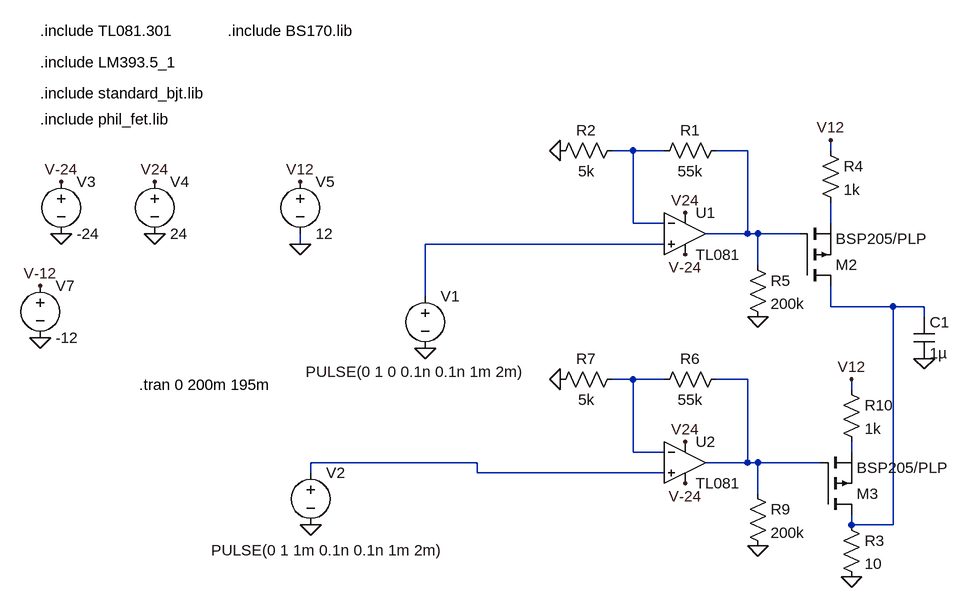
[diagram p0: schematic Prueba_FCorr_MOSfet.asc]
Prueba_FCorr_MOSfet.asc, the LTspice schematic file:
Version 4
SHEET 1 1780 1156
WIRE 752 240 720 240
WIRE 800 240 752 240
WIRE 928 240 880 240
WIRE 1056 240 1056 224
WIRE 752 352 752 240
WIRE 800 352 752 352
WIRE 1056 352 1056 320
WIRE 928 368 928 240
WIRE 928 368 864 368
WIRE 944 368 928 368
WIRE 1008 368 944 368
WIRE 240 384 240 368
WIRE 800 384 432 384
WIRE 944 416 944 368
WIRE 432 464 432 384
WIRE 1056 480 1056 448
WIRE 1152 480 1056 480
WIRE 1200 480 1152 480
WIRE 1200 496 1200 480
WIRE 752 592 720 592
WIRE 800 592 752 592
WIRE 928 592 880 592
WIRE 1088 608 1088 592
WIRE 752 704 752 592
WIRE 800 704 752 704
WIRE 1088 704 1088 688
WIRE 512 720 256 720
WIRE 928 720 928 592
WIRE 928 720 864 720
WIRE 944 720 928 720
WIRE 1040 720 944 720
WIRE 256 736 256 720
WIRE 512 736 512 720
WIRE 800 736 512 736
WIRE 944 768 944 720
WIRE 1088 816 1088 800
WIRE 1152 816 1152 480
WIRE 1152 816 1088 816
FLAG 256 816 0
FLAG 432 544 0
FLAG -128 368 0
FLAG 16 368 0
FLAG -128 288 V-24
FLAG 16 288 V24
FLAG 240 384 0
FLAG 240 288 V12
FLAG 640 240 0
FLAG 832 336 V24
FLAG 1056 224 V12
FLAG 944 496 0
FLAG 832 400 V-24
FLAG -160 528 0
FLAG -160 448 V-12
FLAG 1200 560 0
FLAG 640 592 0
FLAG 832 688 V24
FLAG 1088 592 V12
FLAG 944 848 0
FLAG 832 752 V-24
FLAG 1088 896 0
SYMBOL voltage 432 448 R0
WINDOW 123 0 0 Left 0
WINDOW 39 0 0 Left 0
WINDOW 3 -184 132 Left 2
SYMATTR Value PULSE(0 1 0 0.1n 0.1n 1m 2m)
SYMATTR InstName V1
SYMBOL voltage 256 720 R0
WINDOW 123 0 0 Left 0
WINDOW 39 0 0 Left 0
WINDOW 3 -153 135 Left 2
SYMATTR Value PULSE(0 1 1m 0.1n 0.1n 1m 2m)
SYMATTR InstName V2
SYMBOL voltage -128 272 R0
WINDOW 123 0 0 Left 0
WINDOW 39 0 0 Left 0
SYMATTR InstName V3
SYMATTR Value -24
SYMBOL voltage 16 272 R0
WINDOW 123 0 0 Left 0
WINDOW 39 0 0 Left 0
SYMATTR InstName V4
SYMATTR Value 24
SYMBOL voltage 240 272 R0
WINDOW 123 0 0 Left 0
WINDOW 39 0 0 Left 0
SYMATTR InstName V5
SYMATTR Value 12
SYMBOL Opamps\\opamp2 832 304 R0
SYMATTR InstName U1
SYMATTR Value TL081
SYMBOL res 896 224 R90
WINDOW 0 0 56 VBottom 2
WINDOW 3 32 56 VTop 2
SYMATTR InstName R1
SYMATTR Value 55k
SYMBOL res 736 224 R90
WINDOW 0 0 56 VBottom 2
WINDOW 3 32 56 VTop 2
SYMATTR InstName R2
SYMATTR Value 5k
SYMBOL pmos 1008 448 M180
SYMATTR InstName M2
SYMATTR Value BSP205/PLP
SYMATTR Prefix X
SYMBOL res 928 400 R0
SYMATTR InstName R5
SYMATTR Value 200k
SYMBOL voltage -160 432 R0
WINDOW 123 0 0 Left 0
WINDOW 39 0 0 Left 0
SYMATTR InstName V7
SYMATTR Value -12
SYMBOL res 1040 224 R0
SYMATTR InstName R4
SYMATTR Value 1k
SYMBOL cap 1184 496 R0
SYMATTR InstName C1
SYMATTR Value 1µ
SYMBOL Opamps\\opamp2 832 656 R0
SYMATTR InstName U2
SYMATTR Value TL081
SYMBOL res 896 576 R90
WINDOW 0 0 56 VBottom 2
WINDOW 3 32 56 VTop 2
SYMATTR InstName R6
SYMATTR Value 55k
SYMBOL res 736 576 R90
WINDOW 0 0 56 VBottom 2
WINDOW 3 32 56 VTop 2
SYMATTR InstName R7
SYMATTR Value 5k
SYMBOL res 928 752 R0
SYMATTR InstName R9
SYMATTR Value 200k
SYMBOL res 1072 592 R0
SYMATTR InstName R10
SYMATTR Value 1k
SYMBOL pmos 1040 800 M180
SYMATTR InstName M3
SYMATTR Value BSP205/PLP
SYMATTR Prefix X
SYMBOL res 1072 800 R0
SYMATTR InstName R3
SYMATTR Value 10
TEXT -160 152 Left 2 !.include standard_bjt.lib
TEXT -160 104 Left 2 !.include LM393.5_1
TEXT -160 56 Left 2 !.include TL081.301
TEXT -8 600 Left 2 !.tran 0 200m 195m
TEXT -160 192 Left 2 !.include phil_fet.lib
TEXT 128 56 Left 2 !.include BS170.lib

The netlist it stands for:
* Prueba_FCorr_MOSfet.asc
V1 N004 0 PULSE(0 1 0 0.1n 0.1n 1m 2m)
V2 N009 0 PULSE(0 1 1m 0.1n 0.1n 1m 2m)
V3 V-24 0 -24
V4 V24 0 24
V5 V12 0 12
XU1 N004 N001 V24 V-24 N002 TL081  ; pins In+ In- V+ V- OUT
R1 N002 N001 55k
R2 N001 0 5k
XM2 N005 N002 N003 BSP205/PLP  ; pins D G S
R5 N002 0 200k
V7 V-12 0 -12
R4 V12 N003 1k
C1 N005 0 1µ
XU2 N009 N006 V24 V-24 N007 TL081  ; pins In+ In- V+ V- OUT
R6 N007 N006 55k
R7 N006 0 5k
R9 N007 0 200k
R10 V12 N008 1k
XM3 N005 N007 N008 BSP205/PLP  ; pins D G S
R3 N005 0 10
.include standard_bjt.lib
.include LM393.5_1
.include TL081.301
.tran 0 200m 195m
.include phil_fet.lib
.include BS170.lib
.backanno
.end